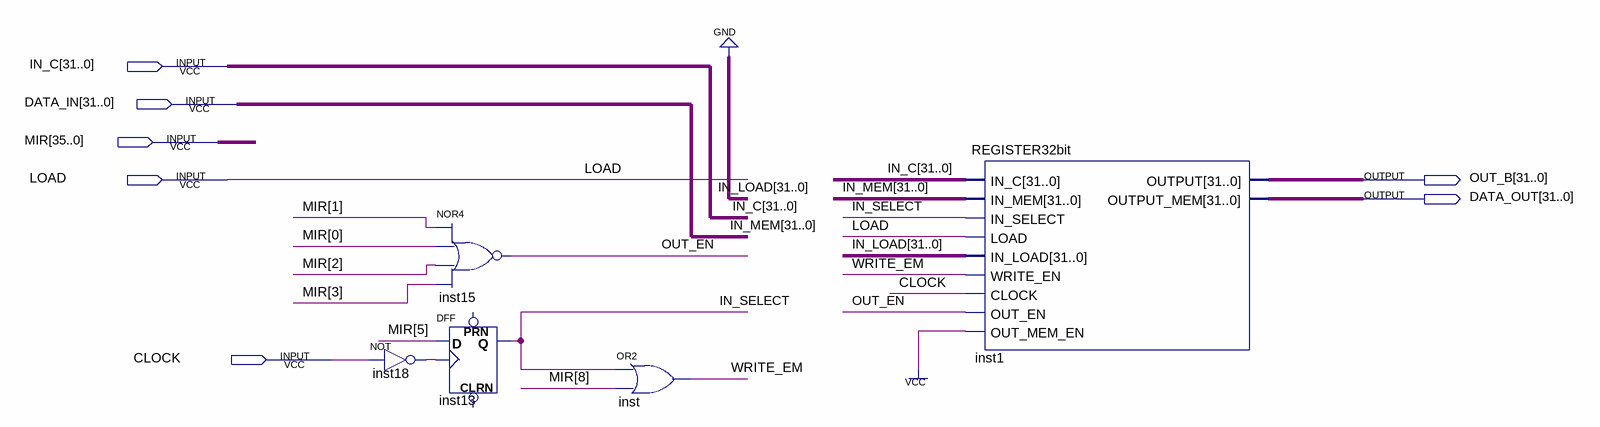
[diagram p0: schematic sheet]
// Quartus schematic MDR.bdf as structural Verilog: 5 symbols, 7 pins
module MDR (
  input  [31:0] IN_C,
  input  [31:0] DATA_IN,
  input  [35:0] MIR,
  input  LOAD,
  input  CLOCK,
  output [31:0] OUT_B,
  output [31:0] DATA_OUT
);

  wire IN_SELECT, inst18_out, OUT_EN, WRITE_EM;

  not inst18 (inst18_out, CLOCK);
  nor inst15 (OUT_EN, MIR[1], MIR[0], MIR[2], MIR[3]);
  DFF inst13 (.CLK(inst18_out), .D(MIR[5]), .Q(IN_SELECT));  // open: CLRN, PRN
  or inst (WRITE_EM, IN_SELECT, MIR[8]);
  REGISTER32bit inst1 (
    .IN_C(IN_C), .IN_MEM(DATA_IN), .IN_SELECT(IN_SELECT), .LOAD(LOAD), .IN_LOAD({32{1'b0}}),
    .WRITE_EN(WRITE_EM), .CLOCK(CLOCK), .OUT_EN(OUT_EN), .OUT_MEM_EN(1'b1), .OUTPUT(OUT_B),
    .OUTPUT_MEM(DATA_OUT));

  // Other names for the same wires on the sheet: IN_MEM[31:0] = DATA_IN
endmodule
